# Altium project IIOT_GATEWAY_MT7621.PrjPcb (part 2 of 2)

## Sheet PCIe to SATA.SchDoc
size 609 x 431 mm
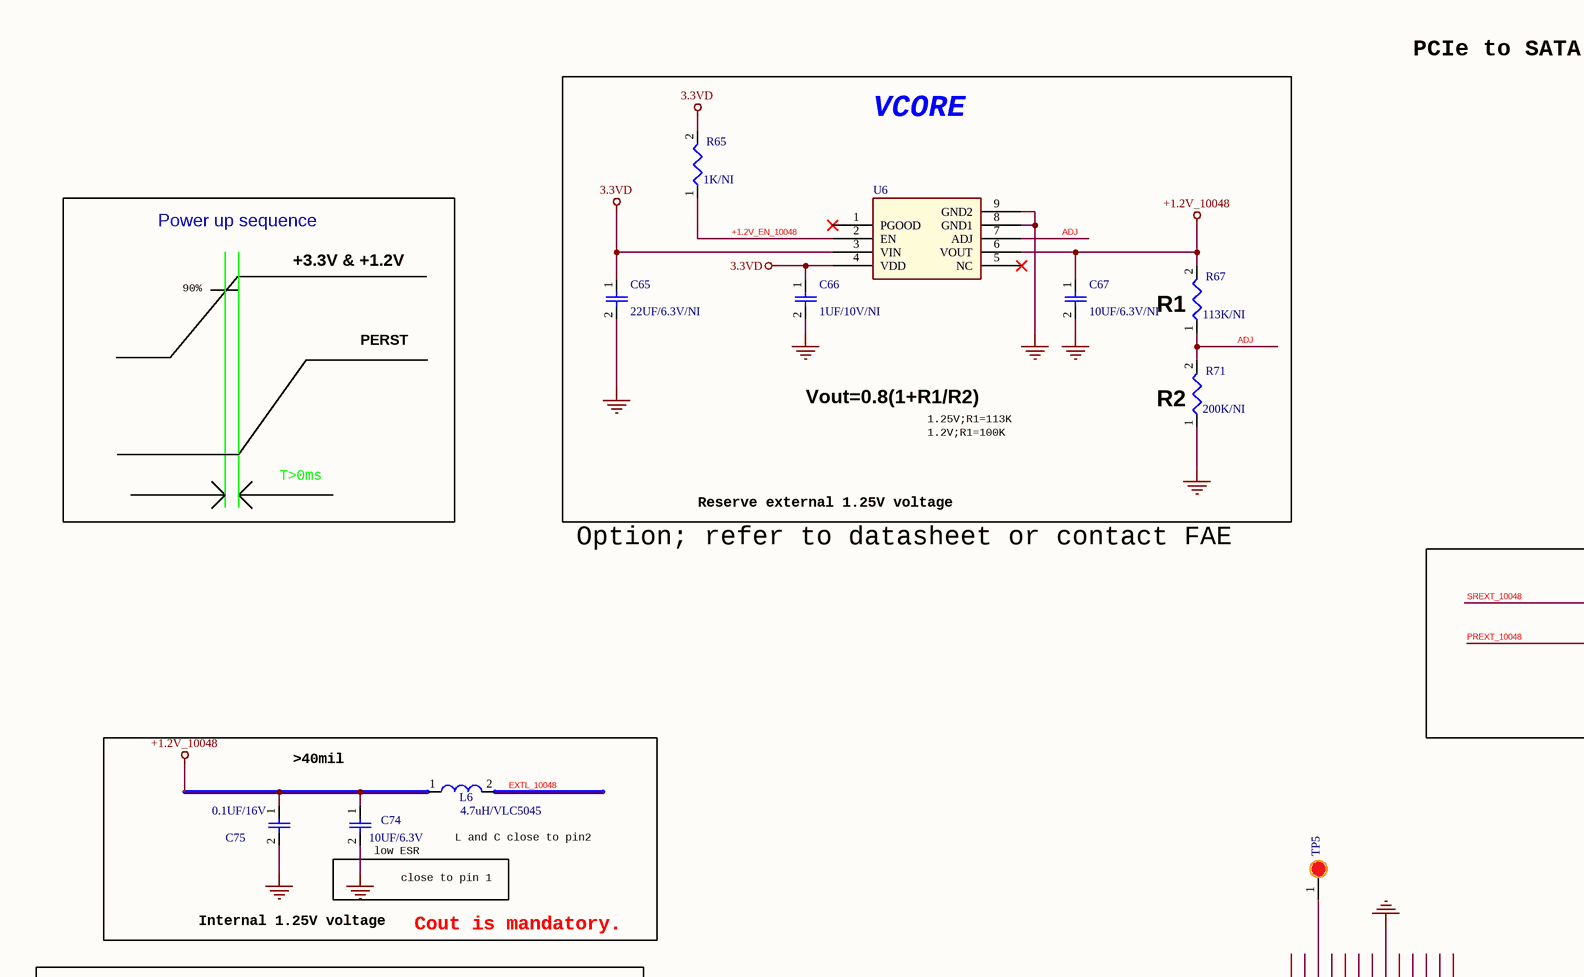
[diagram p6: PCIe to SATA.SchDoc, top left]
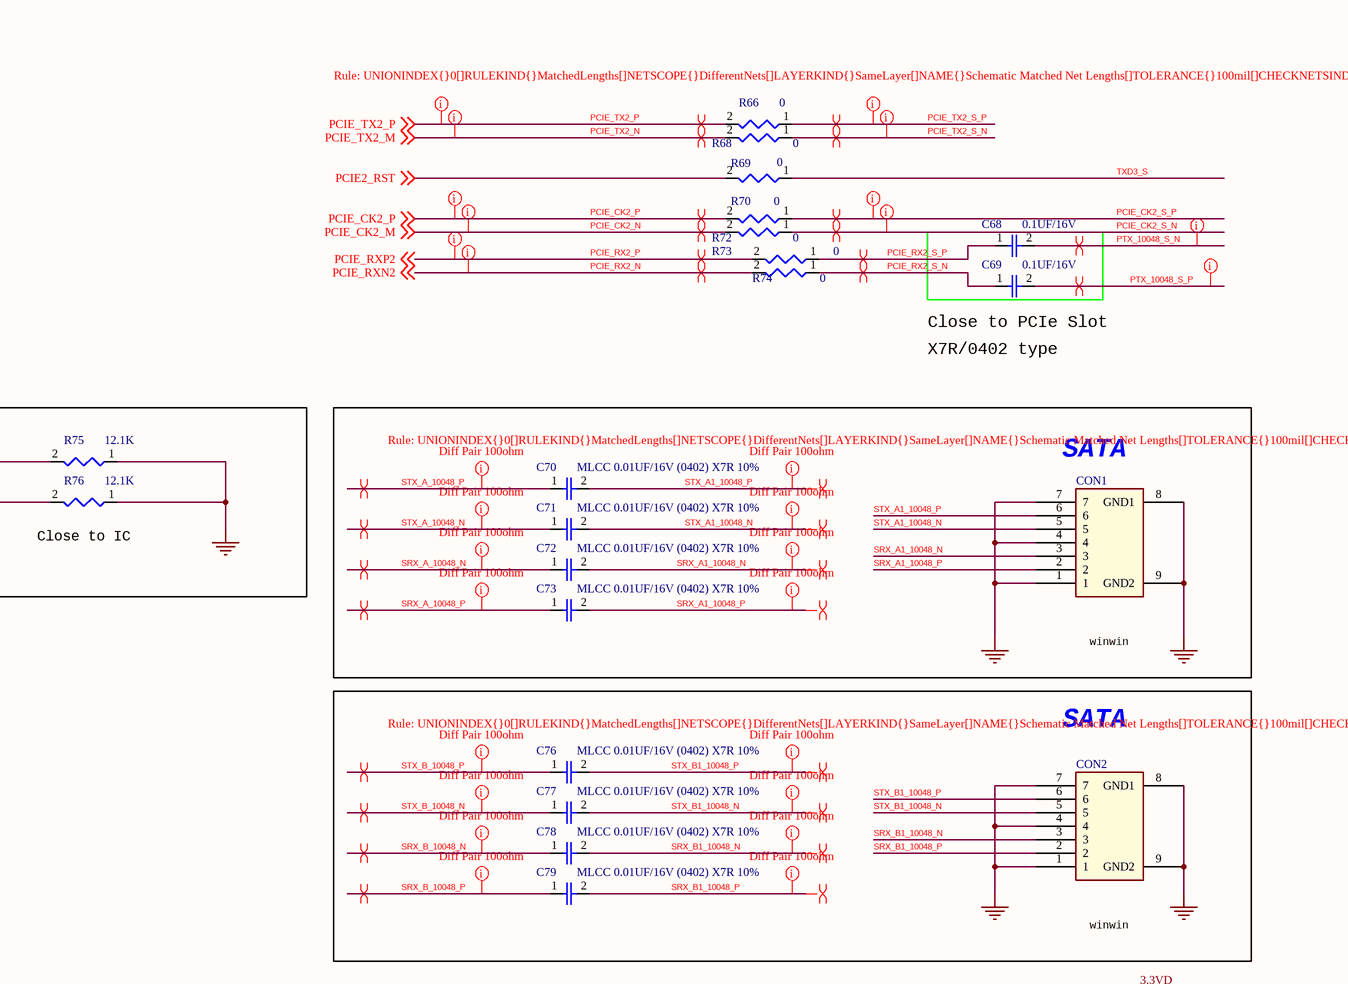
[diagram p7: PCIe to SATA.SchDoc, top right]
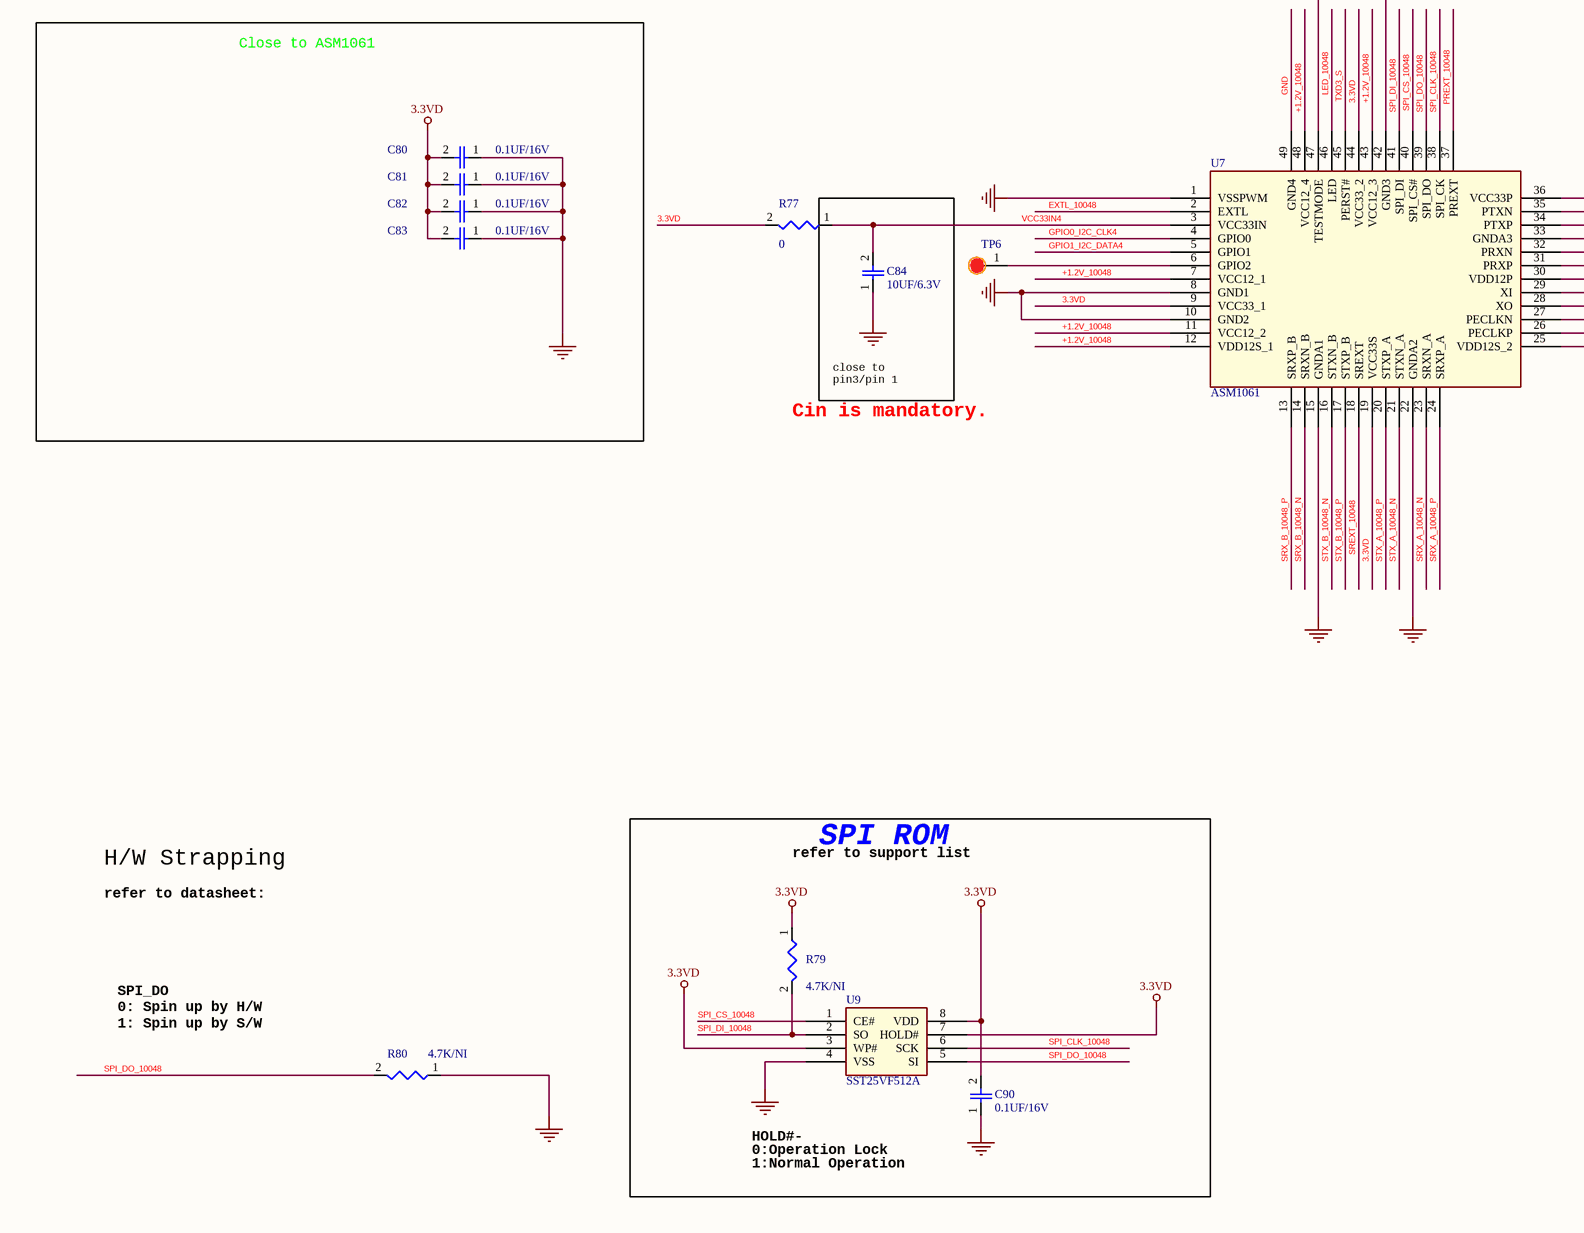
[diagram p8: PCIe to SATA.SchDoc, bottom left]
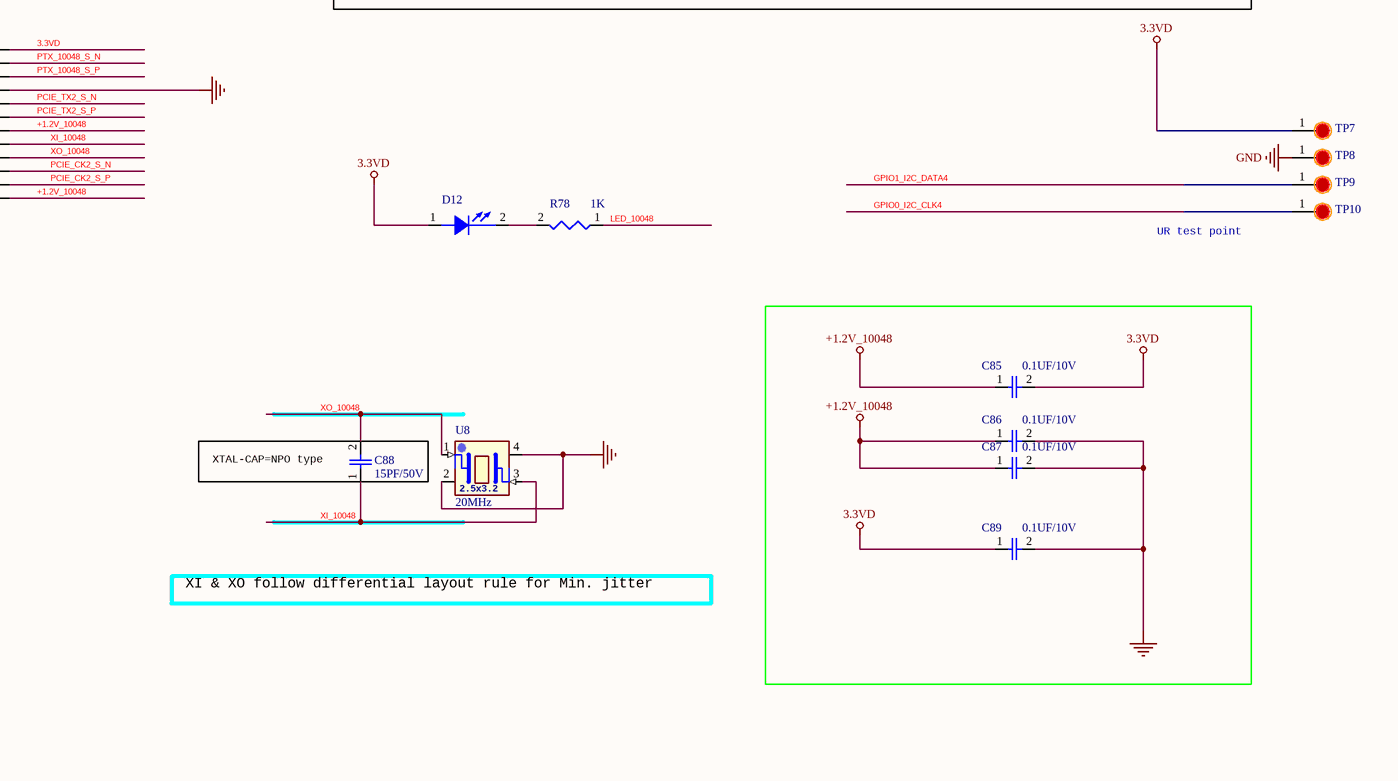
[diagram p9: PCIe to SATA.SchDoc, bottom right]

### Parts
C65  22UF/6.3V/NI  [0805-C]
C66  1UF/10V/NI  [0402-C]
C67  10UF/6.3V/NI  [0603-C]
C68  0.1UF/16V  [0402-C]
C69  0.1UF/16V  [0402-C]
C70  MLCC 0.01UF/16V (0402) X7R 10%  [0402-C]
C71  MLCC 0.01UF/16V (0402) X7R 10%  [0402-C]
C72  MLCC 0.01UF/16V (0402) X7R 10%  [0402-C]
C73  MLCC 0.01UF/16V (0402) X7R 10%  [0402-C]
C74  10UF/6.3V  [0603-C]
C75  0.1UF/16V  [0402-C]
C76  MLCC 0.01UF/16V (0402) X7R 10%  [0402-C]
C77  MLCC 0.01UF/16V (0402) X7R 10%  [0402-C]
C78  MLCC 0.01UF/16V (0402) X7R 10%  [0402-C]
C79  MLCC 0.01UF/16V (0402) X7R 10%  [0402-C]
C80  0.1UF/16V  [0402-C]
C81  0.1UF/16V  [0402-C]
C82  0.1UF/16V  [0402-C]
C83  0.1UF/16V  [0402-C]
C84  10UF/6.3V  [0603-C]
C85  0.1UF/10V  [0402-C]
C86  0.1UF/10V  [0402-C]
C87  0.1UF/10V  [0402-C]
C88  15PF/50V  [0402-C]
C89  0.1UF/10V  [0402-C]
C90  0.1UF/16V  [0402-C]
CON1  SATA_CON_7P_2HOLD  [0678008025]  (value not drawn)
CON2  SATA_CON_7P_2HOLD  [0678008025]  (value not drawn)
D12  LED/0603  [LED_0603]  (value not drawn)
L6  4.7uH/VLC5045  [VLC5045]
R65  1K/NI  [0603-R]
R66  0  [0402-R]
R67  113K/NI  [0402-R]
R68  0  [0402-R]
R69  0  [0402-R]
R70  0  [0402-R]
R71  200K/NI  [0402-R]
R72  0  [0402-R]
R73  0  [0402-R]
R74  0  [0402-R]
R75  12.1K  [0402-R]
R76  12.1K  [0402-R]
R77  0  [0603-R]
R78  1K  [0603-R]
R79  4.7K/NI  [0603-R]
R80  4.7K/NI  [0603-R]
TP5  TP  [TP_SMD]  (value not drawn)
TP6  TP  [TP_SMD]  (value not drawn)
TP7  TP  [TP_SMD]  (value not drawn)
TP8  TP  [TP_SMD]  (value not drawn)
TP9  TP  [TP_SMD]  (value not drawn)
TP10  TP  [TP_SMD]  (value not drawn)
U6  RT9025_25PSP/NI  [SOP-8]  (value not drawn)
U7  ASM1061  [QFN-48]
U8  20MHz  [XTAL_3.2x2.5]
U9  SST25VF512A  [SO-8]

### Blocks framed on the sheet
VCORE: C65-C67 R65 R67 R71 U6
Close to IC: R75 R76
SATA: C70-C73 CON1
Cout is mandatory.: C74 C75 L6
SATA: C76-C79 CON2
Close to ASM1061: C80-C83
XTAL-CAP=NPO type: C88
SPI ROM: C90 R79 U9

### Nets
3.3VD: C65.1 C66.1 C80.2 C81.2 C82.2 C83.2 C85.2 C89.1 C90.2 D12.1(ANODE) R65.2 R77.2 R79.1 TP7.1 U6.3(VIN) U6.4(VDD) U7.9(VCC33_1) U7.19(VCC33S) U7.36(VCC33P) U7.44(VCC33_2) U9.3(WP#) U9.7(HOLD#) U9.8(VDD)
+1.2V_10048: C67.1 C74.1 C75.1 C85.1 C86.1 C87.1 L6.1 R67.2 U6.6(VOUT) U7.7(VCC12_1) U7.11(VCC12_2) U7.12(VDD12S_1) U7.25(VDD12S_2) U7.30(VDD12P) U7.43(VCC12_3) U7.48(VCC12_4)
GND: C65.2 C66.2 C67.2 C74.2 C75.2 C80.1 C81.1 C82.1 C83.1 C84.1 C86.2 C87.2 C89.2 C90.1 CON1.1 CON1.4 CON1.7 CON1.8(GND1) CON1.9(GND2) CON2.1 CON2.4 CON2.7 CON2.8(GND1) CON2.9(GND2) R71.1 R75.1 R76.1 R80.1 TP8.1 U6.8(GND1) U6.9(GND2) U7.1(VSSPWM) U7.8(GND1) U7.10(GND2) U7.15(GNDA1) U7.22(GNDA2) U7.33(GNDA3) U7.42(GND3) U7.49(GND4) U8.2(NC) U8.4(NC) U9.4(VSS)
+1.2V_EN_10048: R65.1 U6.2(EN)
ADJ: R67.1 R71.2 U6.7(ADJ)
EXTL_10048: L6.2 U7.2(EXTL)
GPIO0_I2C_CLK4: TP10.1 U7.4(GPIO0)
GPIO1_I2C_DATA4: TP9.1 U7.5(GPIO1)
LED_10048: R78.1 U7.46(LED)
PCIE2_RST: R69.2 ; off-sheet PCIE2_RST
PCIE_CK2_N: R72.2 ; off-sheet PCIE_CK2_M  [also labelled PCIE_CK2_M]
PCIE_CK2_P: R70.2 ; off-sheet PCIE_CK2_P
PCIE_CK2_S_N: R72.1 U7.27(PECLKN)
PCIE_CK2_S_P: R70.1 U7.26(PECLKP)
PCIE_RX2_N: R74.2 ; off-sheet PCIE_RXN2  [also labelled PCIE_RXN2]
PCIE_RX2_P: R73.2 ; off-sheet PCIE_RXP2  [also labelled PCIE_RXP2]
PCIE_RX2_S_N: C69.1 R74.1
PCIE_RX2_S_P: C68.1 R73.1
PCIE_TX2_N: R68.2 ; off-sheet PCIE_TX2_M  [also labelled PCIE_TX2_M]
PCIE_TX2_P: R66.2 ; off-sheet PCIE_TX2_P
PCIE_TX2_S_N: R68.1 U7.32(PRXN)
PCIE_TX2_S_P: R66.1 U7.31(PRXP)
PREXT_10048: R76.2 U7.37(PREXT)
PTX_10048_S_N: C68.2 U7.35(PTXN)
PTX_10048_S_P: C69.2 U7.34(PTXP)
SPI_CLK_10048: U7.38(SPI_CK) U9.6(SCK)
SPI_CS_10048: U7.40(SPI_CS#) U9.1(CE#)
SPI_DI_10048: R79.2 U7.41(SPI_DI) U9.2(SO)
SPI_DO_10048: R80.2 U7.39(SPI_DO) U9.5(SI)
SREXT_10048: R75.2 U7.18(SREXT)
SRX_A1_10048_N: C72.2 CON1.3
SRX_A1_10048_P: C73.2 CON1.2
SRX_A_10048_N: C72.1 U7.23(SRXN_A)
SRX_A_10048_P: C73.1 U7.24(SRXP_A)
SRX_B1_10048_N: C78.2 CON2.3
SRX_B1_10048_P: C79.2 CON2.2
SRX_B_10048_N: C78.1 U7.14(SRXN_B)
SRX_B_10048_P: C79.1 U7.13(SRXP_B)
STX_A1_10048_N: C71.2 CON1.5
STX_A1_10048_P: C70.2 CON1.6
STX_A_10048_N: C71.1 U7.21(STXN_A)
STX_A_10048_P: C70.1 U7.20(STXP_A)
STX_B1_10048_N: C77.2 CON2.5
STX_B1_10048_P: C76.2 CON2.6
STX_B_10048_N: C77.1 U7.16(STXN_B)
STX_B_10048_P: C76.1 U7.17(STXP_B)
TXD3_S: R69.1 U7.45(PERST#)
VCC33IN4: C84.2 R77.1 U7.3(VCC33IN)
XI_10048: C88.1 U7.29(XI) U8.3(X2)
XO_10048: C88.2 U7.28(XO) U8.1(X1)
NetD12_2: D12.2(CATHODE) R78.2
NetTP5_1: TP5.1 U7.47(TESTMODE)
NetTP6_1: TP6.1 U7.6(GPIO2)

Not connected (* = marked no-connect by the designer): U6 1(PGOOD)* 5(NC)*

### Layout directives
differential pair; differential pair class DIFF100: PCIE_CK2_N, PCIE_CK2_P, PCIE_CK2_S_N, PCIE_CK2_S_P, PCIE_RX2_N, PCIE_RX2_P, PCIE_RX2_S_N, PCIE_RX2_S_P, PCIE_TX2_N, PCIE_TX2_P, PCIE_TX2_S_N, PCIE_TX2_S_P, PTX_10048_S_N, PTX_10048_S_P, SRX_A1_10048_N, SRX_A1_10048_P, SRX_A_10048_N, SRX_A_10048_P, SRX_B1_10048_N, SRX_B1_10048_P, SRX_B_10048_N, SRX_B_10048_P, STX_A1_10048_N, STX_A1_10048_P, STX_A_10048_N, STX_A_10048_P, STX_B1_10048_N, STX_B1_10048_P, STX_B_10048_N, STX_B_10048_P
rule Matched Net Lengths [Tolerance = 100mil]: PCIE_CK2_N, PCIE_CK2_P, PCIE_CK2_S_N, PCIE_CK2_S_P, PCIE_RX2_N, PCIE_RX2_P, PCIE_TX2_N, PCIE_TX2_P, PCIE_TX2_S_N, PCIE_TX2_S_P, PTX_10048_S_N, PTX_10048_S_P, SRX_A1_10048_N, SRX_A1_10048_P, SRX_A_10048_N, SRX_A_10048_P, SRX_B1_10048_N, SRX_B1_10048_P, SRX_B_10048_N, SRX_B_10048_P, STX_A1_10048_N, STX_A1_10048_P, STX_A_10048_N, STX_A_10048_P, STX_B1_10048_N, STX_B1_10048_P, STX_B_10048_N, STX_B_10048_P

### Notes on the sheet
- PCIe to SATA
- Power up sequence
- +3.3V & +1.2V
- 90%
- (near R67) R1
- PERST
- Vout=0.8(1+R1/R2)
- 1.25V;R1=113K
- 1.2V;R1=100K
- (near R71) R2
- (near C69) Close to PCIe Slot
- T>0ms
- Reserve external 1.25V voltage
- X7R/0402 type
- Option; refer to datasheet or contact FAE
- >40mil
- winwin
- (near C74) low ESR
- (near L6) L and C close to pin2
- Internal 1.25V voltage
- close to pin 1
- close to
  pin3/pin 1
- UR test point
- Cin is mandatory.
- XI & XO follow differential layout rule for Min. jitter
- H/W Strapping
- refer to support list
- refer to datasheet:
- SPI_DO
  0: Spin up by H/W
  1: Spin up by S/W
- HOLD#-
- 0:Operation Lock
- 1:Normal Operation
- (in symbol XTAL_3.2x2.5) 2.5x3.2

### Library data of the parts
C65-C90 = CAP
L6 = IND/VLC5045
R65-R80 = Res
TP5-TP10 = Test Pad
U6 = RT9025_25PSP
U8 = XTAL_3.2x2.5
U9 = SST25VF512A: 512 Kbit SPI Serial Flash

## Sheet PCIe Slot.SchDoc
size A3
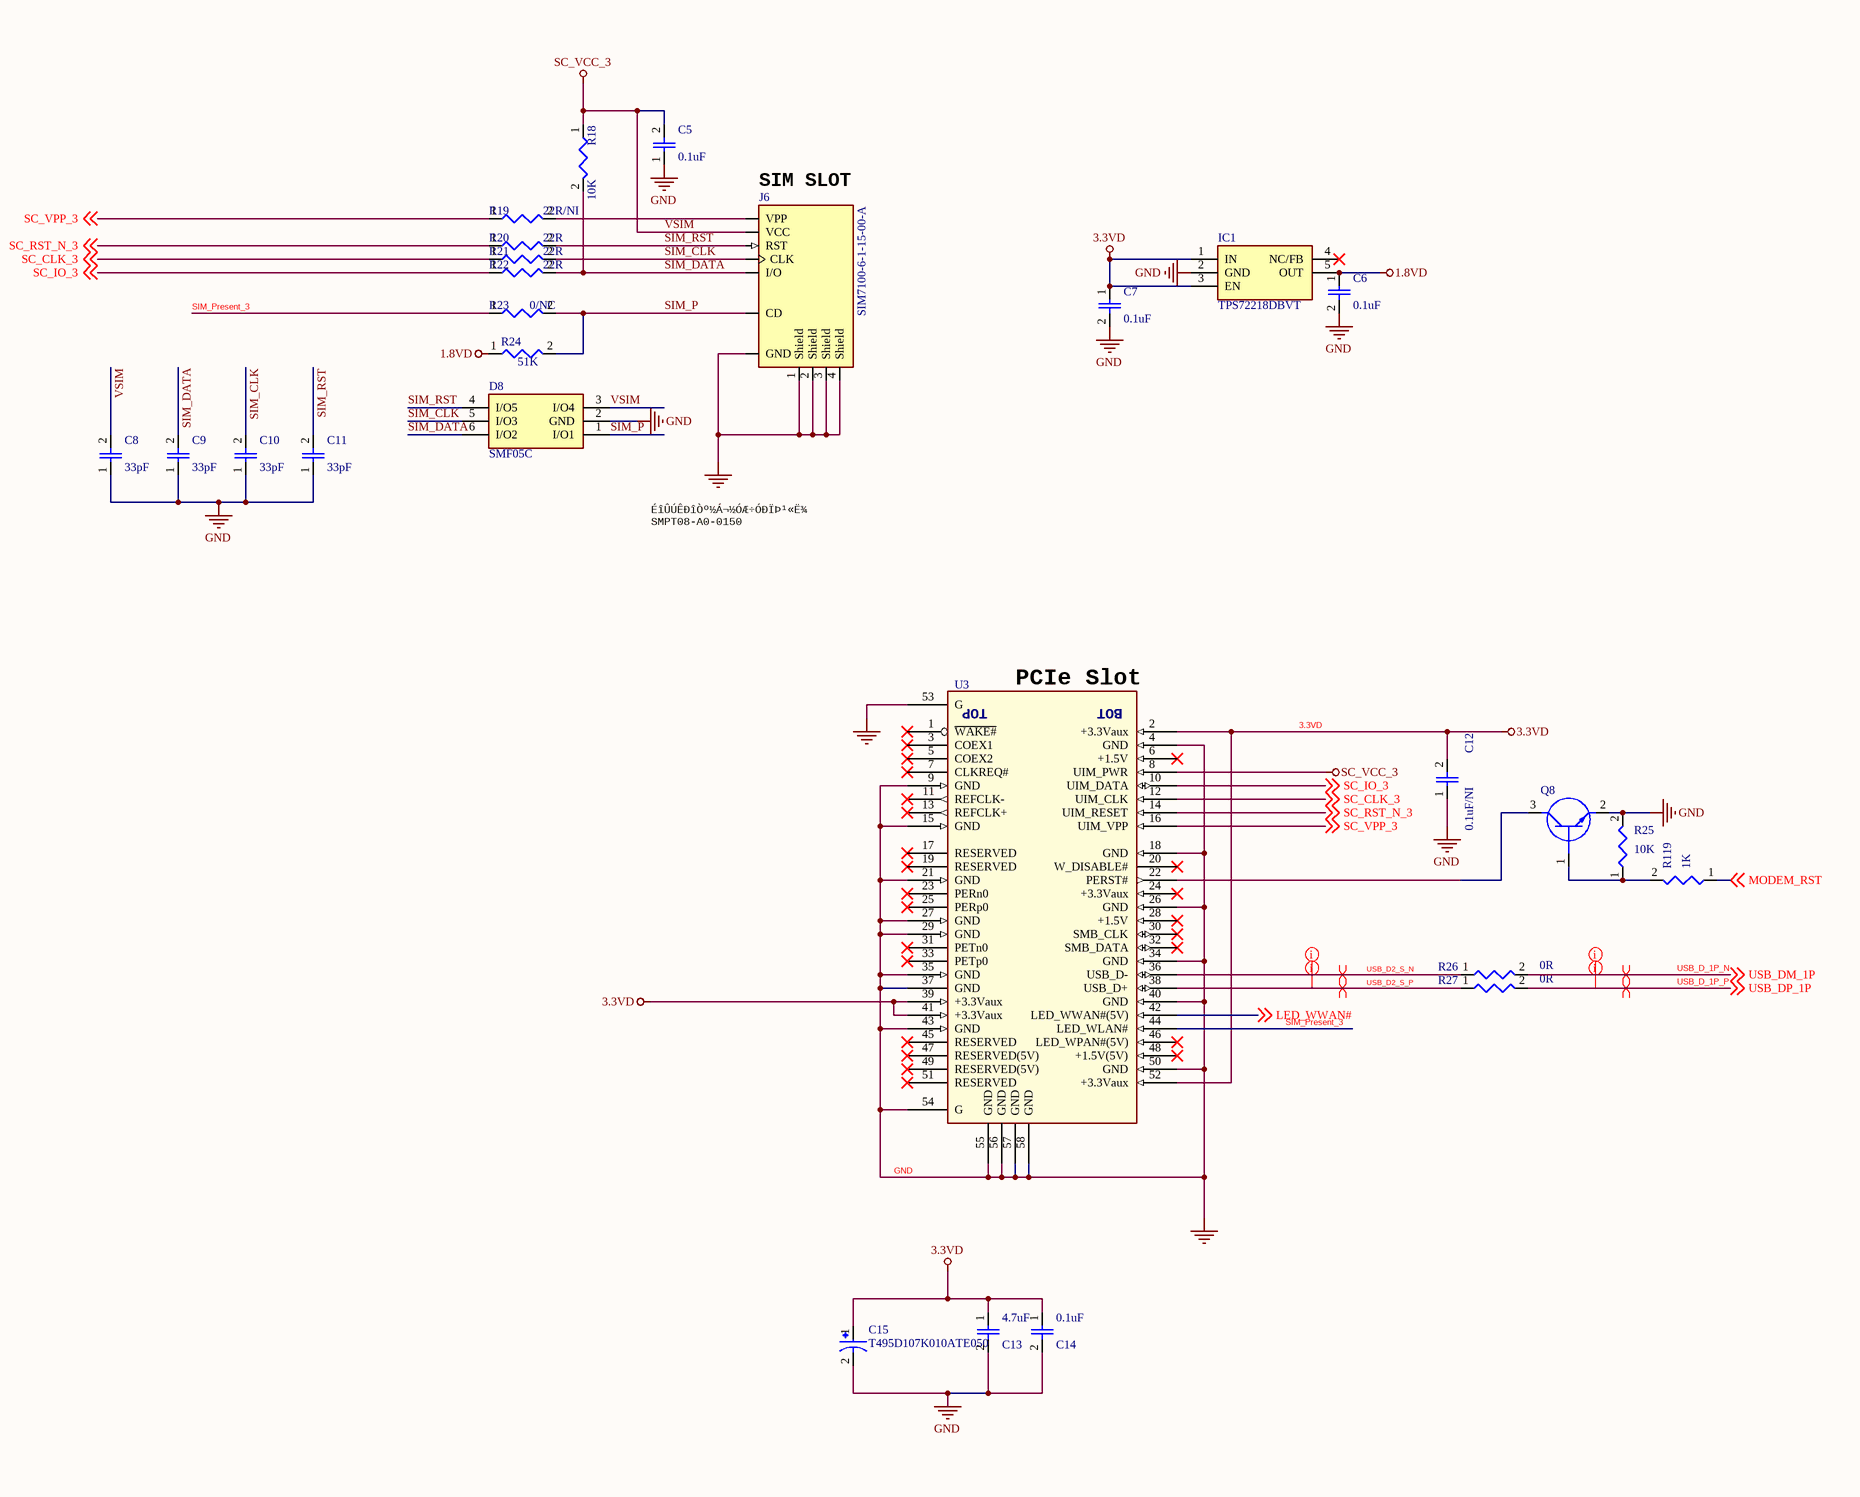
[diagram p10: PCIe Slot.SchDoc, left]
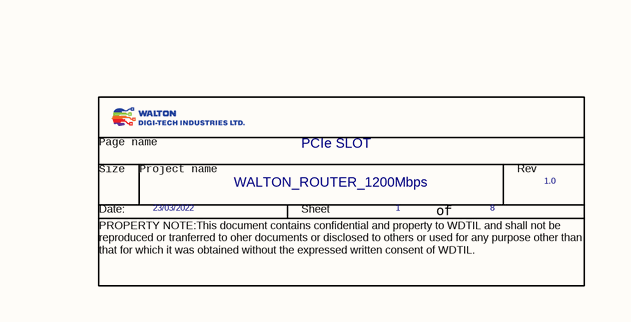
[diagram p11: PCIe Slot.SchDoc, right]

### Parts
*?  Page Number: 1  Page Count: 8  Page Modify Date: 23/03/2022  Doc: WALTON_ROUTER_1200Mbps  RevCode: 1.0  Title: PCIe SLOT  (hidden comment: W_LOGO)  (graphical)
C5  0.1uF  [0603-C]
C6  0.1uF  [0603-C]
C7  0.1uF  [0603-C]
C8  33pF  [0402-C]
C9  33pF  [0402-C]
C10  33pF  [0402-C]
C11  33pF  [0402-C]
C12  0.1uF/NI  [0402-C]
C13  4.7uF  [0603-C]
C14  0.1uF  [0402-C]
C15  T495D107K010ATE050  [CAP_4TAE470ML]
D8  SMF05C  [SOT65P210X110-6N]
IC1  TPS72218DBVT  [SOT95P280X145-5N]
J6  SIM7100-6-1-15-00-A  [GCT_SIM7100-6-1-15-00-A_REVC]
Q8  MMBT2222A-G  [SOT95P240X115-3N]  (value not drawn)
R18  10K  [0402-R]
R19  22R/NI  [0402-R]
R20  22R  [0402-R]
R21  22R  [0402-R]
R22  22R  [0402-R]
R23  0/NC  [0402-R]
R24  51K  [0402-R]
R25  10K  [0402-R]
R26  0R  [0402-R]
R27  0R  [0402-R]
R119  1K  [0402-R]
U3  1759513-1  [TE_1775838-2]  (value not drawn)

### Nets
1.8VD: C6.1 IC1.5(OUT) R24.1
3.3VD: C7.1 C12.2 C13.1 C14.1 C15.1 IC1.1(IN) IC1.3(EN) U3.2(+3.3Vaux) U3.39(+3.3Vaux) U3.41(+3.3Vaux) U3.52(+3.3Vaux)
GND: C5.1 C6.2 C7.2 C8.1 C9.1 C10.1 C11.1 C12.1 C13.2 C14.2 C15.2 D8.2(GND) IC1.2(GND) J6.1(Shield) J6.2(Shield) J6.3(Shield) J6.4(Shield) J6.C5(GND) Q8.2(E) R25.2 U3.4(GND) U3.9(GND) U3.15(GND) U3.18(GND) U3.21(GND) U3.26(GND) U3.27(GND) U3.29(GND) U3.34(GND) U3.35(GND) U3.37(GND) U3.40(GND) U3.43(GND) U3.50(GND) U3.53(G) U3.54(G) U3.55(GND) U3.56(GND) U3.57(GND) U3.58(GND)
VSIM: C5.2 C8.2 D8.3(I/O4) J6.C1(VCC) R18.1 U3.8(UIM_PWR)  [also labelled SC_VCC_3]
LED_WWAN#: U3.42(LED_WWAN#(5V)) ; off-sheet LED_WWAN#
MODEM_RST: R119.1 ; off-sheet MODEM_RST
SC_CLK_3: R21.1 U3.12(UIM_CLK) ; off-sheet SC_CLK_3
SC_IO_3: R22.1 U3.10(UIM_DATA) ; off-sheet SC_IO_3
SC_RST_N_3: R20.1 U3.14(UIM_RESET) ; off-sheet SC_RST_N_3
SC_VPP_3: R19.1 U3.16(UIM_VPP) ; off-sheet SC_VPP_3
SIM_CLK: C10.2 D8.5(I/O3) J6.C3(CLK) R21.2
SIM_DATA: C9.2 D8.6(I/O2) J6.C7(I/O) R18.2 R22.2
SIM_P: D8.1(I/O1) J6.CD R23.2 R24.2
SIM_Present_3: R23.1 U3.44(LED_WLAN#)
SIM_RST: C11.2 D8.4(I/O5) J6.C2(RST) R20.2
USB_D2_S_N: R26.1 U3.36(USB_D-)
USB_D2_S_P: R27.1 U3.38(USB_D+)
USB_D_1P_N: R26.2 ; off-sheet USB_DM_1P  [also labelled USB_DM_1P]
USB_D_1P_P: R27.2 ; off-sheet USB_DP_1P  [also labelled USB_DP_1P]
NetJ6_C6: J6.C6(VPP) R19.2
NetQ8_1: Q8.1(B) R25.1 R119.2
NetQ8_3: Q8.3(C) U3.22(PERST#)

Not connected (* = marked no-connect by the designer): IC1 4(NC/FB)*; U3 1(~{WAKE#})* 3(COEX1)* 5(COEX2)* 6(+1.5V)* 7(CLKREQ#)* 11(REFCLK-)* 13(REFCLK+)* 17(RESERVED)* 19(RESERVED)* 20(W_DISABLE#)* 23(PERn0)* 24(+3.3Vaux)* 25(PERp0)* 28(+1.5V)* 30(SMB_CLK)* 31(PETn0)* 32(SMB_DATA)* 33(PETp0)* 45(RESERVED)* 46(LED_WPAN#(5V))* 47(RESERVED(5V))* 48(+1.5V(5V))* 49(RESERVED(5V))* 51(RESERVED)*

### Layout directives
differential pair; differential pair class DIFF90: USB_D2_S_N, USB_D2_S_P, USB_D_1P_N, USB_D_1P_P
rule Matched Net Lengths [Tolerance = 100mil]: USB_D2_S_N, USB_D2_S_P, USB_D_1P_N, USB_D_1P_P

### Notes on the sheet
- (near J6) SIM SLOT
- ÉîÛÚÊÐîÒº½Á¬½ÓÆ÷ÓÐÏÞ¹«Ë¾
  SMPT08-A0-0150
- (near U3) PCIe Slot
- (in symbol 1775838-2) TOP; BOT
- (in symbol W_LOGO) Page name; Size; Project name; Rev; Date:; Sheet; of; PROPERTY NOTE:This document contains confidential and property to WDTIL and shall not be reproduced or tranferred to oher documents or disclosed to others or used for any purpose other than that for which it was obtained without the expressed written consent of WDTIL.

### Library data of the parts
C5-C7 C12-C14 = CAP
C8-C11 = CAP_2
C15 = T495D107K010ATE050: Cap Tant Solid 100uF 10V D CASE 10% (7.3 X 4.3 X 2.8mm) SMD 7343-31 0.05 Ohm 125°C T/R; Manufacturer: KEMET; ESR (Equivalent Series Resistance): 50mR; Polarity: Polar; Life (Hours): 2000Hour; Dissipation Factor: 8%; Supplier 1: Newark; Manufacturer Part Number: T495D107K010ATE050; RoHS: Yes; Category: Tantalum Capacitors; Stock 1: 224; Pricing 1: 1=2.46000, 10=2.00000, 25=1.84000, 50=1.69000, 100=1.53000 (USD); Mount: Surface Mount; Case/Package: 2917; Number of Pins: 2; Case Code (Imperial): 2917; Case Code (Metric): 7343; Min Operating Temperature: -55°C; Max Operating Temperature: 125°C; Packaging: Tape and Reel; Capacitance: 100uF; Tolerance: 10%; Voltage Rating: 10V; Package Quantity: 500; Termination: SMD/SMT; Voltage Rating (DC): 10V; Features: General Purpose; Series: T495; Construction: Flat; Length: 7.3mm; Width: 4.3mm; Height: 3.1mm; Height - Seated (Max): 0.122inch; Depth: 4.3mm; Radiation Hardening: No; REACH SVHC: No SVHC; RoHS Compliant: Yes; ComponentLink1URL: http://www.farnell.com/datasheets/2319914.pdf?src-supplier=Farnell; ComponentLink1Description: http://www.farnell.com/datasheets/2319914.pdf?src-supplier=Farnell; ComponentLink2URL: http://www.mouser.com/ds/2/212/KEM_T2071_T495_COTS-1104607.pdf?src-supplier=Mouser; ComponentLink2Description: http://www.mouser.com/ds/2/212/KEM_T2071_T495_COTS-1104607.pdf?src-supplier=Mouser; ComponentLink3URL: http://www.farnell.com/datasheets/2015705.pdf?src-supplier=Farnell; ComponentLink3Description: http://www.farnell.com/datasheets/2015705.pdf?src-supplier=Farnell; ComponentLink4URL: http://www.farnell.com/datasheets/2015705.pdf?src-supplier=Element14; ComponentLink4Description: http://www.farnell.com/datasheets/2015705.pdf?src-supplier=Element14; ComponentLink5URL: https://api.kemet.com/component-edge/download/datasheet/T495D107K010ASE100.pdf?src-supplier=Digi-Key; ComponentLink5Description: https://api.kemet.com/component-edge/download/datasheet/T495D107K010ASE100.pdf?src-supplier=Digi-Key; ComponentLink6URL: http://www.kemet.com/Lists/ProductCatalog/Attachments/261/KEM_T2009_T495.pdf?src-supplier=Avnet; ComponentLink6Description: http://www.kemet.com/Lists/ProductCatalog/Attachments/261/KEM_T2009_T495.pdf?src-supplier=Avnet; ComponentLink7URL: http://www.kemet.com/kemet/web/homepage/kechome.nsf/weben/1AABD97F96BDDBDA8525795A0050FFCA/$file/KEM_T2009_T495.pdf?src-supplier=Avnet; ComponentLink7Description: http://www.kemet.com/kemet/web/homepage/kechome.nsf/weben/1AABD97F96BDDBDA8525795A0050FFCA/$file/KEM_T2009_T495.pdf?src-supplier=Avnet; ComponentLink8URL: http://www.farnell.com/datasheets/2319914.pdf?src-supplier=Newark; ComponentLink8Description: http://www.farnell.com/datasheets/2319914.pdf?src-supplier=Newark; ComponentLink9URL: http://components.arrow.com/part/dataview/44988739S8665845N7429?src-supplier=Arrow+Electronics; ComponentLink9Description: http://components.arrow.com/part/dataview/44988739S8665845N7429?src-supplier=Arrow+Electronics; Supplier Part Number 1: 77Y7860
D8 = SMF05C: Diode; Manufacturer_Name: SEMTECH; Datasheet Link: https://semtech.my.salesforce.com/sfc/p/E0000000JelG/a/2R000000HTur/oh5IBNMxy439tUCWCfUixX8WnZBmvf43yHAHJowoBrc; Height: 1.1mm; Manufacturer_Part_Number: SMF05C
IC1 = TPS72218DBVT: Integrated Circuit; Manufacturer_Name: Texas Instruments; Datasheet Link: http://www.ti.com/lit/gpn/tps722; Height: 1.45mm; Manufacturer_Part_Number: TPS72218DBVT; Mouser Part Number: 595-TPS72218DBVT; Mouser Price/Stock: https://www.mouser.co.uk/ProductDetail/Texas-Instruments/TPS72218DBVT?qs=Gse6rAGbi7%2F5%252BPwDKEmoQQ%3D%3D; Arrow Part Number: TPS72218DBVT; Arrow Price/Stock: https://www.arrow.com/en/products/tps72218dbvt/texas-instruments
J6 = SIM7100-6-1-15-00-A_REVC: 7 _6 + 1_ Position Card Connector Micro SIM Surface Mount, Right Angle Gold; MF: Global Connector Technology; Package: None; Availability: Unavailable; SnapEDA_Link: https://www.snapeda.com/parts/SIM7100-6-1-15-00-A/Global%20Connector%20Technology/view-part/449163/?ref=snap; MP: SIM7100-6-1-15-00-A; Price: None; Value: *
Q8 = MMBT2222A-G: Transistor BJT NPN; Manufacturer_Name: Comchip Technology; Datasheet Link: https://datasheet.datasheetarchive.com/originals/distributors/Datasheets-7/DSA-138996.pdf; Height: 1.15mm; Manufacturer_Part_Number: MMBT2222A-G; Mouser Part Number: 750-MMBT2222A-G; Mouser Price/Stock: https://www.mouser.co.uk/ProductDetail/Comchip-Technology/MMBT2222A-G?qs=2qJf6qQ4IOIM%2FSE9iCL8gQ%3D%3D; Arrow Part Number: MMBT2222A-G; Arrow Price/Stock: https://www.arrow.com/en/products/mmbt2222a-g/comchip-technology?region=nac
R18-R24 R26 R27 = Res
R25 R119 = Res_19
U3 = 1775838-2: 0.8MM MINI PCI EXPRESS CONNECTOR 9H

## Sheet RS485.SchDoc
size A4
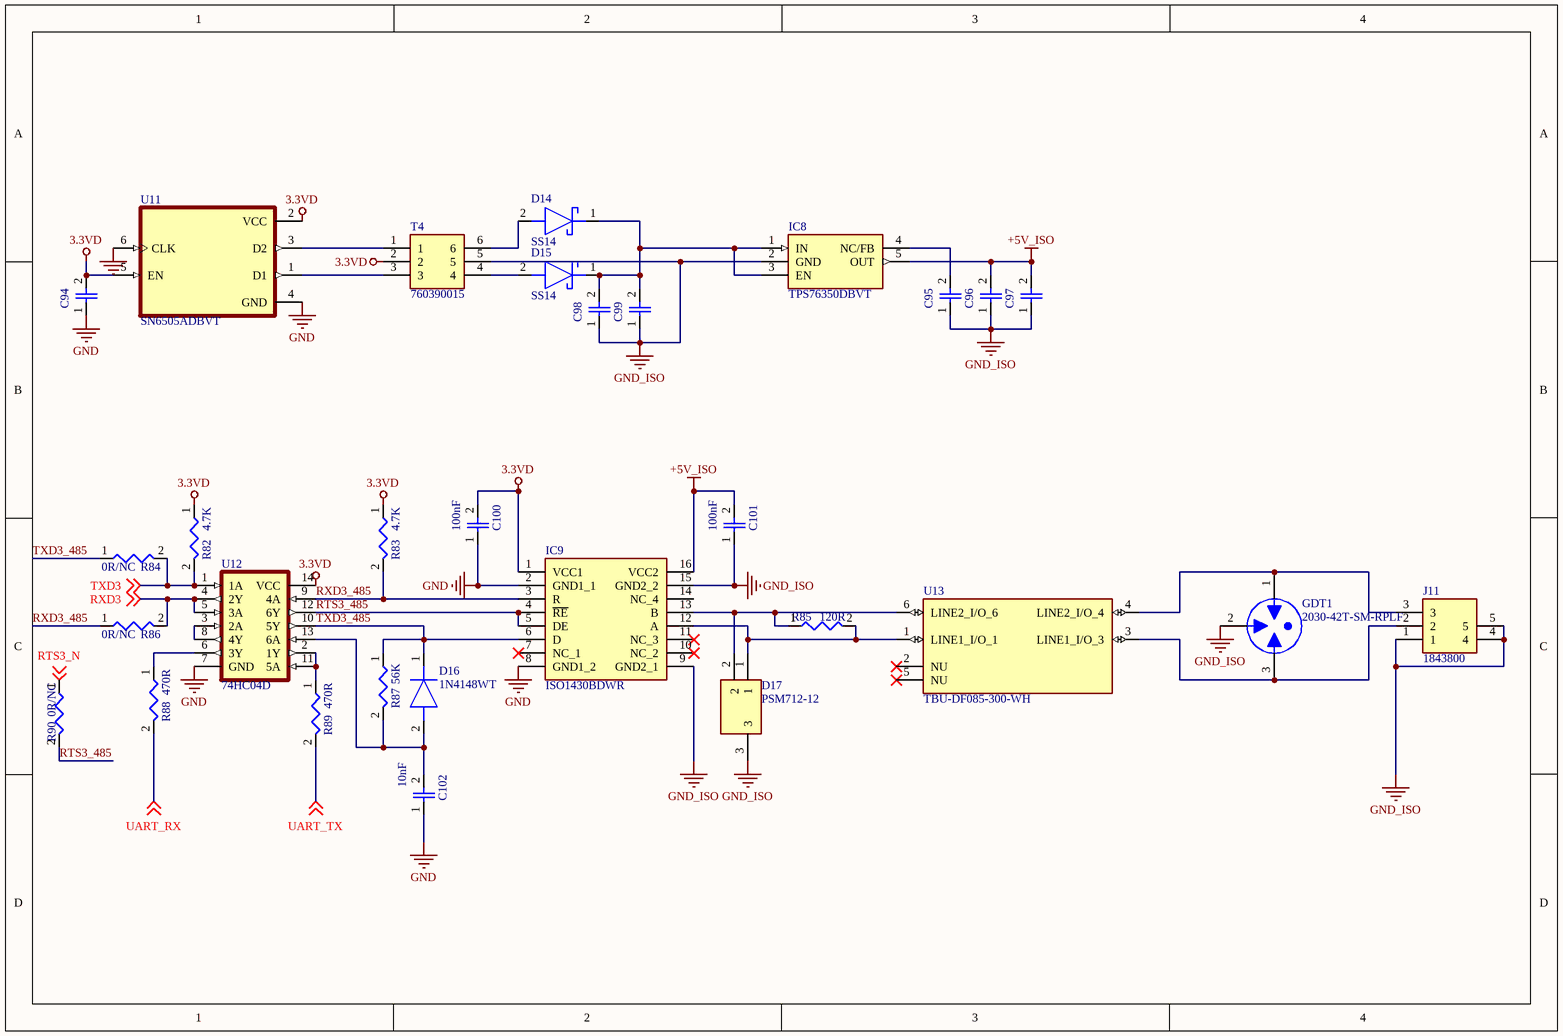
[diagram p12: RS485.SchDoc]

### Parts
C94  10uF,0805  [0805-C]  (value not drawn)
C95  10nF,0603/NC  [0603-C]  (value not drawn)
C96  10uF,0805  [0805-C]  (value not drawn)
C97  0.1uF,0603  [0603-C]  (value not drawn)
C98  10uF,0805  [0805-C]  (value not drawn)
C99  0.1uF,0603  [0603-C]  (value not drawn)
C100  100nF  [0603-C]
C101  100nF  [0603-C]
C102  10nF  [0603-C]
D14  SS14  [DIOM5127X261N]
D15  SS14  [DIOM5127X261N]
D16  1N4148WT  [SODFL1608X70N]
D17  PSM712-12  [PSM71212]
GDT1  2030-42T-SM-RPLF  [2030-42T-SM-RPLF]
IC8  TPS76350DBVT  [SOT95P280X145-5N]
IC9  ISO1430BDWR  [SOIC127P1030X265-16N]
J11  1843800  [1843800]
R82  4.7K  [0603-R]
R83  4.7K  [0603-R]
R84  0R/NC  [0603-R]
R85  120R  [0603-R]
R86  0R/NC  [0603-R]
R87  56K  [0603-R]
R88  470R  [0603-R]
R89  470R  [0603-R]
R90  0R/NC  [0603-R]
T4  760390015  [760390015]
U11  SN6505ADBVT  [SOT95P280X145-6N]
U12  74HC04D  [SOIC127P600X175-14N]
U13  TBU-DF085-300-WH  [IC_TBU-DF085-300-WH]

### Nets
3.3VD: C94.2 C100.2 IC9.1(VCC1) R82.1 R83.1 T4.2 U11.2(VCC) U11.5(EN) U12.14(VCC)
+5V_ISO: C96.2 C97.2 C101.2 IC8.5(OUT) IC9.16(VCC2)
GND: C94.1 C100.1 C102.1 IC9.2(GND1_1) IC9.8(GND1_2) U11.4(GND) U11.6(CLK) U12.7(GND)
GND_ISO: C95.1 C96.1 C97.1 C98.1 C99.1 C101.1 D17.3 GDT1.2(E) IC8.2(GND) IC9.9(GND2_1) IC9.15(GND2_2) J11.1 J11.4 J11.5 T4.5
RTS3_485: IC9.4(~{RE}) IC9.5(DE) R90.2 U12.12(6Y)
RTS3_N: R90.1 ; off-sheet RTS3_N
RXD3: R86.2 U12.4(2Y) U12.5(3A) ; off-sheet RXD3
RXD3_485: IC9.3(R) R83.2 R86.1 U12.9(4A)
TXD3: R82.2 R84.2 U12.1(1A) ; off-sheet TXD3
TXD3_485: D16.1(K) IC9.6(D) R84.1 R87.1 U12.10(5Y)
UART_RX: R88.2 ; off-sheet UART_RX
UART_TX: R89.2 ; off-sheet UART_TX
NetC95_2: C95.2 IC8.4(NC/FB)
NetC98_2: C98.2 C99.2 D14.1(K) D15.1(K) IC8.1(IN) IC8.3(EN)
NetC102_2: C102.2 D16.2(A) R87.2 U12.13(6A)
NetD14_2: D14.2(A) T4.6
NetD15_2: D15.2(A) T4.4
NetD17_1: D17.1 IC9.12(A) R85.2 U13.1(LINE1_I/O_1)
NetD17_2: D17.2 IC9.13(B) R85.1 U13.6(LINE2_I/O_6)
NetGDT1_1: GDT1.1(A) J11.3 U13.4(LINE2_I/O_4)
NetGDT1_3: GDT1.3(B) J11.2 U13.3(LINE1_I/O_3)
NetR88_1: R88.1 U12.6(3Y)
NetR89_1: R89.1 U12.2(1Y) U12.11(5A)
NetT4_1: T4.1 U11.3(D2)
NetT4_3: T4.3 U11.1(D1)
NetU12_3: U12.3(2A) U12.8(4Y)

Not connected (* = marked no-connect by the designer): IC9 7(NC_1)* 10(NC_2)* 11(NC_3)* 14(NC_4); U13 2(NU)* 5(NU)*

### Library data of the parts
C94-C102 = CAP
D14 D15 = SS14: Schottky Diode; Manufacturer_Name: MULTICOMP; Datasheet Link: https://componentsearchengine.com/Datasheets/2/SS14.pdf; Height: 2.61mm; Manufacturer_Part_Number: SS14
D16 = 1N4148WT: Diode; Manufacturer_Name: SEMTECH; Datasheet Link: https://datasheet.lcsc.com/szlcsc/Semtech-1N4148WT_C27748.pdf; Height: 0.7mm; Manufacturer_Part_Number: 1N4148WT
D17 = PSM712-12: TVS Diode (Bi-directional); Manufacturer_Name: ProTek Devices; Datasheet Link: http://www.protekdevices.com/xyz/documents/datasheets/psm712.pdf; Height: 1.21mm; Manufacturer_Part_Number: PSM712-12
GDT1 = 2030-42T-SM-RPLF: Gas Discharge Tube 90V 10000A _10kA_ 3 Pole Through Hole; MF: Littelfuse Inc.; MP: SL1021A090R; Value: *; Availability: Unavailable; Package: Axial Cylinder Littelfuse; Price: None; SnapEDA_Link: https://www.snapeda.com/parts/SL1021A090R/Littelfuse%20Inc./view-part/554396/?ref=snap
IC8 = TPS76350DBVT: Integrated Circuit; Manufacturer_Name: Texas Instruments; Datasheet Link: https://datasheet.datasheetarchive.com/originals/distributors/SFDatasheet-6/sf-000132493.pdf; Height: 1.45mm; Manufacturer_Part_Number: TPS76350DBVT; Mouser Part Number: 595-TPS76350DBVT; Mouser Price/Stock: https://www.mouser.co.uk/ProductDetail/Texas-Instruments/TPS76350DBVT?qs=8yeEWhuAOtP%2FFGo0oRuSfA%3D%3D; Arrow Part Number: TPS76350DBVT; Arrow Price/Stock: https://www.arrow.com/en/products/tps76350dbvt/texas-instruments?region=nac
IC9 = ISO1430BDWR: Integrated Circuit; Manufacturer_Name: Texas Instruments; Datasheet Link: http://www.ti.com/lit/gpn/ISO1430; Height: 2.65mm; Manufacturer_Part_Number: ISO1430BDWR; Mouser Part Number: 595-ISO1430BDWR; Mouser Price/Stock: https://www.mouser.co.uk/ProductDetail/Texas-Instruments/ISO1430BDWR?qs=EBDBlbfErPz8lerRTXnR0w%3D%3D; Arrow Part Number: ISO1430BDWR; Arrow Price/Stock: https://www.arrow.com/en/products/iso1430bdwr/texas-instruments?region=nac
J11 = 1843800: Connector; Manufacturer_Name: Phoenix Contact; Datasheet Link: http://www.phoenixcontact.com/de/produkte/1843800/pdf; Height: 7.4mm; Manufacturer_Part_Number: 1843800; Mouser Part Number: 651-1843800; Mouser Price/Stock: https://www.mouser.co.uk/ProductDetail/Phoenix-Contact/1843800?qs=uJX40y%252BSWqgV2WPXXVa%2FDw%3D%3D; Arrow Part Number: 1843800; Arrow Price/Stock: https://www.arrow.com/en/products/1843800/phoenix-contact?region=nac
R82-R90 = Res
T4 = 760390015: Transformer; Manufacturer_Name: Wurth Elektronik; Datasheet Link: https://www.we-online.com/components/products/datasheet/760390015.pdf; Manufacturer_Part_Number: 760390015; Mouser Part Number: 710-760390015; Mouser Price/Stock: https://www.mouser.co.uk/ProductDetail/Wurth-Elektronik/760390015?qs=wElim4iM2pjOQCmk%252B8YbFA%3D%3D
U11 = SN6505ADBVT: Low-noise, 1-A, 160-kHz transformer driver with soft start for isolated power supplies 6-SOT-23 -55 to 125; MF: Texas Instruments; Texas_Instruments-Purchase-URL: https://snapeda.com/shop?store=Texas+Instruments&id=779078; Value: *; Availability: Unavailable; SnapEDA_Link: https://www.snapeda.com/parts/SN6505ADBVT/Texas%20Instruments/view-part/779078/?ref=snap; Package: SOT-23-6 Texas Instruments; MP: SN6505ADBVT; Price: None; BuyPart: https://www.snapeda.com/parts/SN6505ADBVT/Texas%20Instruments/view-part/779078/?ref=eda
U12 = 74HC04D: Inverter IC 6 Channel 14-SOIC; MF: Toshiba; Value: *; MP: 74HC04D; Package: SOIC-14 NXP Semiconductors; Price: None; Availability: Unavailable; SnapEDA_Link: https://www.snapeda.com/parts/74HC04D/Toshiba%20Semiconductor%20and%20Storage/view-part/1040011/?ref=snap
U13 = TBU-DF085-300-WH: DUAL BI-DIR TBU 850V 300MA; MF: Bourns Inc.; SnapEDA_Link: https://www.snapeda.com/parts/TBU-DF085-300-WH/Bourns/view-part/?ref=snap; Availability: In Stock; Purchase-URL: https://pricing.snapeda.com/search/part/TBU-DF085-300-WH/?ref=eda; Check_prices: https://www.snapeda.com/parts/TBU-DF085-300-WH/Bourns/view-part/?ref=eda; Value: *; Package: TDFN-6 Bourns Inc.; MP: TBU-DF085-300-WH; Price: None

## Nets that join several sheets
3.3VD: PMU (9 pins), USB3.0_Console (J1.1), uSD (9 pins), PCIe to SATA (23 pins), PCIe Slot (11 pins), RS485 (9 pins)
GND: DC_DC_ISO (16 pins), PMU (50 pins), TRANSFORMER_RJ45 (41 pins), USB3.0_Console (10 pins), uSD (12 pins), PCIe to SATA (42 pins), PCIe Slot (40 pins), RS485 (8 pins)
USB0_5V_3: PMU (C34.1 IC7.9), USB3.0_Console (C3.2 U1.1)
VOUT_5V: DC_DC_ISO (11 pins), PMU (D9.1 D9.2 IC3.4 TP2.1)